# EAGLE design clockport nic (EAGLE 7.6.0)
PROJECT_NAME: Amiga Clockport Network Interface

## Sheet 1 of 2
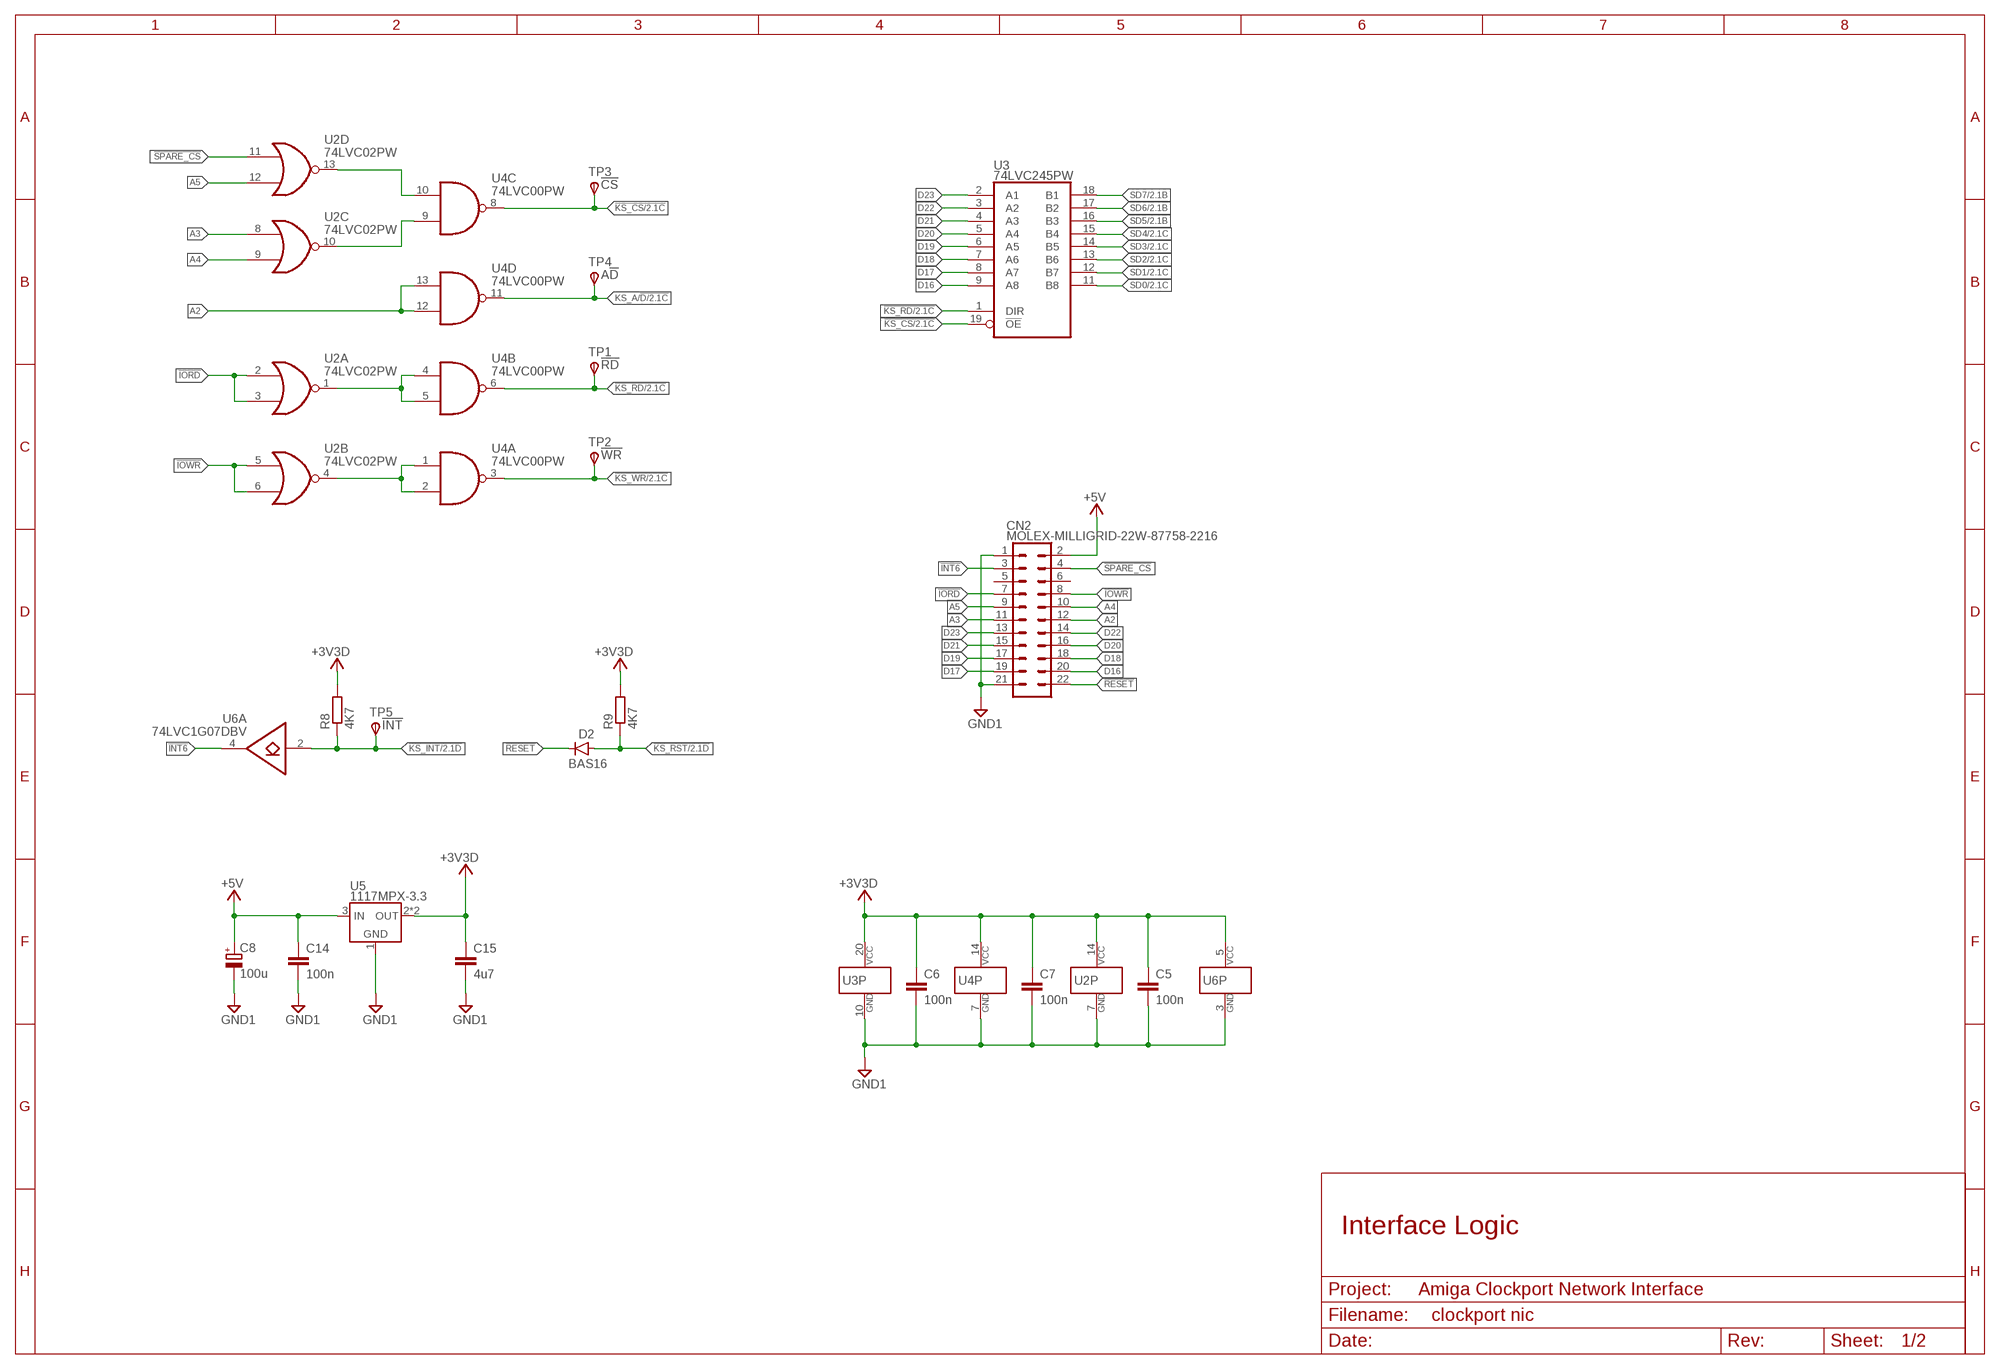
[diagram p0: schematic, sheet 1]

### Parts
C5  100n  C-EUC0603  [C0603]
C6  100n  C-EUC0603  [C0603]
C7  100n  C-EUC0603  [C0603]
C8  100u  CPOL-EUE2.5-6  [E2,5-6]
C14  100n  C-EUC0603  [C0603]
C15  4u7  C-EUC0805  [C0805]
CN2  MOLEX-MILLIGRID-22W-87758-2216  [MOLEX-87758-2216]
D2  BAS16  -DIODE_SOD-323  [SOD323-R]
R8  4K7  R-EU_R0603  [R0603]
R9  4K7  R-EU_R0603  [R0603]
TP1  TPSB1,27  [B1,27]
TP2  TPSB1,27  [B1,27]
TP3  TPSB1,27  [B1,27]
TP4  TPSB1,27  [B1,27]
TP5  TPSB1,27  [B1,27]
U2  74LVC02PW  [TSSOP14]
U3  74LVC245PW  [TSSOP20]
U4  74LVC00PW  [TSSOP14]
U5  1117MPX-3.3  [SOT223]
U6  74LVC1G07DBV  [SOT23-5]

### Nets
!INT6: CN2.3 U6.4(A:O)
!IORD: CN2.7 U2.2(A:I0) U2.3(A:I1)
!IOWR: CN2.8 U2.5(B:I0) U2.6(B:I1)
!KS_CS: TP3.TP(PP) U3.19(!OE) U4.8(C:O) ; also sheet 2
!KS_INT: R8.1 TP5.TP(PP) U6.2(A:I) ; also sheet 2
!KS_RD: TP1.TP(PP) U3.1(DIR) U4.6(B:O) ; also sheet 2
!KS_RST: D2.A R9.1 ; also sheet 2
!KS_WR: TP2.TP(PP) U4.3(A:O) ; also sheet 2
!RESET: CN2.22 D2.K(C)
!SPARE_CS: CN2.4 U2.11(D:I0)
+3V3D: C5.1 C6.1 C7.1 C15.1 R8.2 R9.2 U2.14(P:VCC) U3.20(VCC) U4.14(P:VCC) U5.2(OUT) U5.4(OUT) U6.5(P:VCC) ; also sheet 2
+5V: C8.+ C14.1 CN2.2 U5.3(IN)
A2: CN2.12 U4.12(D:I1) U4.13(D:I0)
A3: CN2.11 U2.8(C:I0)
A4: CN2.10 U2.9(C:I1)
A5: CN2.9 U2.12(D:I1)
D16: CN2.20 U3.9(A8)
D17: CN2.19 U3.8(A7)
D18: CN2.18 U3.7(A6)
D19: CN2.17 U3.6(A5)
D20: CN2.16 U3.5(A4)
D21: CN2.15 U3.4(A3)
D22: CN2.14 U3.3(A2)
D23: CN2.13 U3.2(A1)
GND1: C5.2 C6.2 C7.2 C8.- C14.2 C15.2 CN2.1 CN2.21 U2.7(P:GND) U3.10(GND) U4.7(P:GND) U5.1(GND) U6.3(P:GND) ; also sheet 2
KS_A/!D: TP4.TP(PP) U4.11(D:O) ; also sheet 2
N$1: U2.4(B:O) U4.1(A:I0) U4.2(A:I1)
N$2: U2.1(A:O) U4.4(B:I0) U4.5(B:I1)
N$13: U2.10(C:O) U4.9(C:I1)
N$14: U2.13(D:O) U4.10(C:I0)
SD0: U3.11(B8) ; also sheet 2
SD1: U3.12(B7) ; also sheet 2
SD2: U3.13(B6) ; also sheet 2
SD3: U3.14(B5) ; also sheet 2
SD4: U3.15(B4) ; also sheet 2
SD5: U3.16(B3) ; also sheet 2
SD6: U3.17(B2) ; also sheet 2
SD7: U3.18(B1) ; also sheet 2
Unconnected: CN2.5 CN2.6

### Notes on the sheet
- Interface Logic

## Sheet 2 of 2
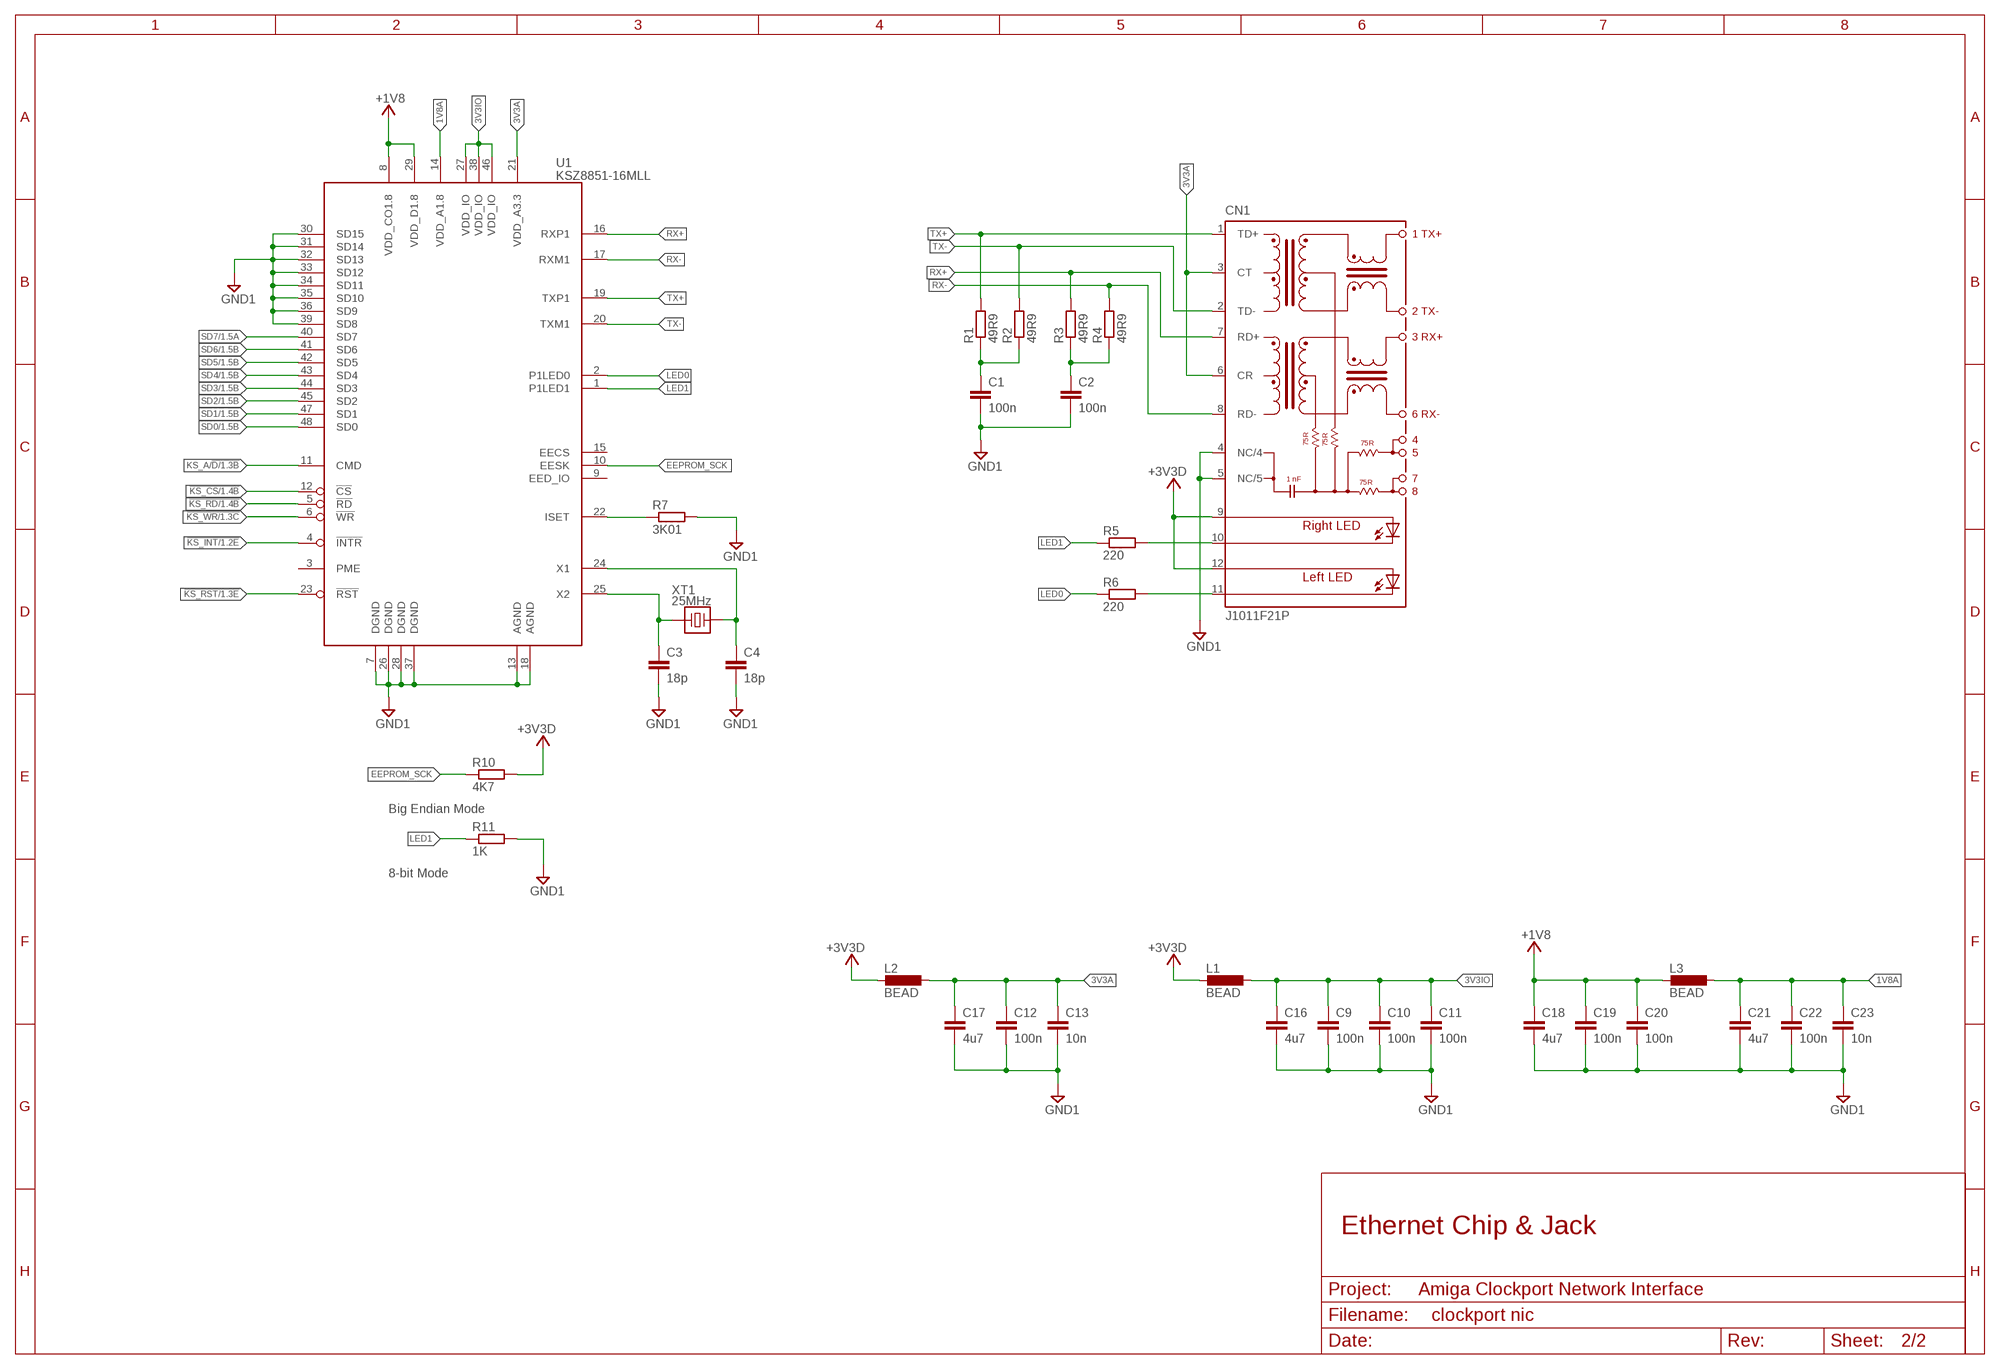
[diagram p1: schematic, sheet 2]

### Parts
C1  100n  C-EUC0603  [C0603]
C2  100n  C-EUC0603  [C0603]
C3  18p  C-EUC0603  [C0603]
C4  18p  C-EUC0603  [C0603]
C9  100n  C-EUC0603  [C0603]
C10  100n  C-EUC0603  [C0603]
C11  100n  C-EUC0603  [C0603]
C12  100n  C-EUC0603  [C0603]
C13  10n  C-EUC0603  [C0603]
C16  4u7  C-EUC0805  [C0805]
C17  4u7  C-EUC0805  [C0805]
C18  4u7  C-EUC0805  [C0805]
C19  100n  C-EUC0603  [C0603]
C20  100n  C-EUC0603  [C0603]
C21  4u7  C-EUC0805  [C0805]
C22  100n  C-EUC0603  [C0603]
C23  10n  C-EUC0603  [C0603]
CN1  J1011F21P  [J1]
L1  BEAD  L-EUL2012C  [L2012C]
L2  BEAD  L-EUL2012C  [L2012C]
L3  BEAD  L-EUL2012C  [L2012C]
R1  49R9  R-EU_R0603  [R0603]
R2  49R9  R-EU_R0603  [R0603]
R3  49R9  R-EU_R0603  [R0603]
R4  49R9  R-EU_R0603  [R0603]
R5  220  R-EU_R0603  [R0603]
R6  220  R-EU_R0603  [R0603]
R7  3K01  R-EU_R0603  [R0603]
R10  4K7  R-EU_R0603  [R0603]
R11  1K  R-EU_R0603  [R0603]
U1  KSZ8851-16MLL  [LQFP48]
XT1  25MHz  XTAL_3225  [3225_4PAD]

### Nets
1V8A: C21.1 C22.1 C23.1 L3.1 U1.14(VDD_A1.8)
3V3A: C12.1 C13.1 C17.1 CN1.3(CT) CN1.6(CR) L2.1 U1.21(VDD_A3.3)
3V3IO: C9.1 C10.1 C11.1 C16.1 L1.1 U1.27(VDD_IO) U1.38(VDD_IO) U1.46(VDD_IO)
!KS_CS: U1.12(!CS) ; also sheet 1
!KS_INT: U1.4(!INTR) ; also sheet 1
!KS_RD: U1.5(!RD) ; also sheet 1
!KS_RST: U1.23(!RST) ; also sheet 1
!KS_WR: U1.6(!WR) ; also sheet 1
+1V8: C18.1 C19.1 C20.1 L3.2 U1.8(VDD_CO1.8) U1.29(VDD_D1.8)
+3V3D: CN1.9(A-R) CN1.12(AL) L1.2 L2.2 R10.2 ; also sheet 1
EEPROM_SCK: R10.1 U1.10(EESK)
GND1: C1.2 C2.2 C3.2 C4.2 C9.2 C10.2 C11.2 C12.2 C13.2 C16.2 C17.2 C18.2 C19.2 C20.2 C21.2 C22.2 C23.2 CN1.4(NC/4) CN1.5(NC/5) R7.2 R11.2 U1.7(DGND) U1.13(AGND) U1.18(AGND) U1.26(DGND) U1.28(DGND) U1.30(SD15) U1.31(SD14) U1.32(SD13) U1.33(SD12) U1.34(SD11) U1.35(SD10) U1.36(SD9) U1.37(DGND) U1.39(SD8) ; also sheet 1
ISET: R7.1 U1.22(ISET)
KS_A/!D: U1.11(CMD) ; also sheet 1
LED0: R6.1 U1.2(P1LED0)
LED1: R5.1 R11.1 U1.1(P1LED1)
N$6: C2.1 R3.1 R4.1
N$7: CN1.11(C-L) R6.2
N$8: CN1.10(C-R) R5.2
N$9: C1.1 R1.1 R2.1
RX+: CN1.7(RD+) R3.2 U1.16(RXP1)
RX-: CN1.8(RD-) R4.2 U1.17(RXM1)
SD0: U1.48(SD0) ; also sheet 1
SD1: U1.47(SD1) ; also sheet 1
SD2: U1.45(SD2) ; also sheet 1
SD3: U1.44(SD3) ; also sheet 1
SD4: U1.43(SD4) ; also sheet 1
SD5: U1.42(SD5) ; also sheet 1
SD6: U1.41(SD6) ; also sheet 1
SD7: U1.40(SD7) ; also sheet 1
TX+: CN1.1(TD+) R1.2 U1.19(TXP1)
TX-: CN1.2(TD-) R2.2 U1.20(TXM1)
XT1: C4.1 U1.24(X1) XT1.3
XT2: C3.1 U1.25(X2) XT1.1
Unconnected: U1.3(PME) U1.9(EED_IO) U1.15(EECS)

### Notes on the sheet
- Big Endian Mode
- 8-bit Mode
- Ethernet Chip & Jack

## Library data of the parts
C1-C7 C9-C23 = rcl:C-EU: CAPACITOR, European symbol
C8 = rcl:CPOL-EU: POLARIZED CAPACITOR, European symbol
CN1 = con-pulse:J1011F: PULSEJACK (TM) 1x1 Tab-UP RJ45 10/100 Base-TX RJ45 1x1 Tab-UP with LEDs 8-pin (J1 series) and 6-pin (JP series) integrated magnetics connector, designed to support applications, such as ADSL modems, LAN-on-Motherboard, and Hub and Switches. Source: www.pulseeng.com .. PulseJack-J402.pdf; OC_FARNELL: unknown; OC_NEWARK: unknown
CN2 = jc-connectors:MOLEX-MILLIGRID-22W-?
D2 = jc-discretesemi:*-DIODE_?
L1-L3 = rcl:L-EU: INDUCTOR, European symbol
R1-R11 = rcl:R-EU_: RESISTOR, European symbol
TP1 = testpad:TPS: TEST PIN; TP_SIGNAL_NAME: !RD
TP2 = testpad:TPS: TEST PIN; TP_SIGNAL_NAME: !WR
TP3 = testpad:TPS: TEST PIN; TP_SIGNAL_NAME: !CS
TP4 = testpad:TPS: TEST PIN; TP_SIGNAL_NAME: A!D
TP5 = testpad:TPS: TEST PIN; TP_SIGNAL_NAME: !INT
U1 = jc-ic:KSZ8851-16MLL
U2 = jc-logic:74*02: Quad 2-input NOR
U3 = jc-logic:74*245
U4 = jc-logic:74*00: Quad 2-input NAND
U5 = jc-vreg:1117?-
U6 = jc-logic:74LVC1G07
XT1 = jc-oscillators:XTAL_*

## Board
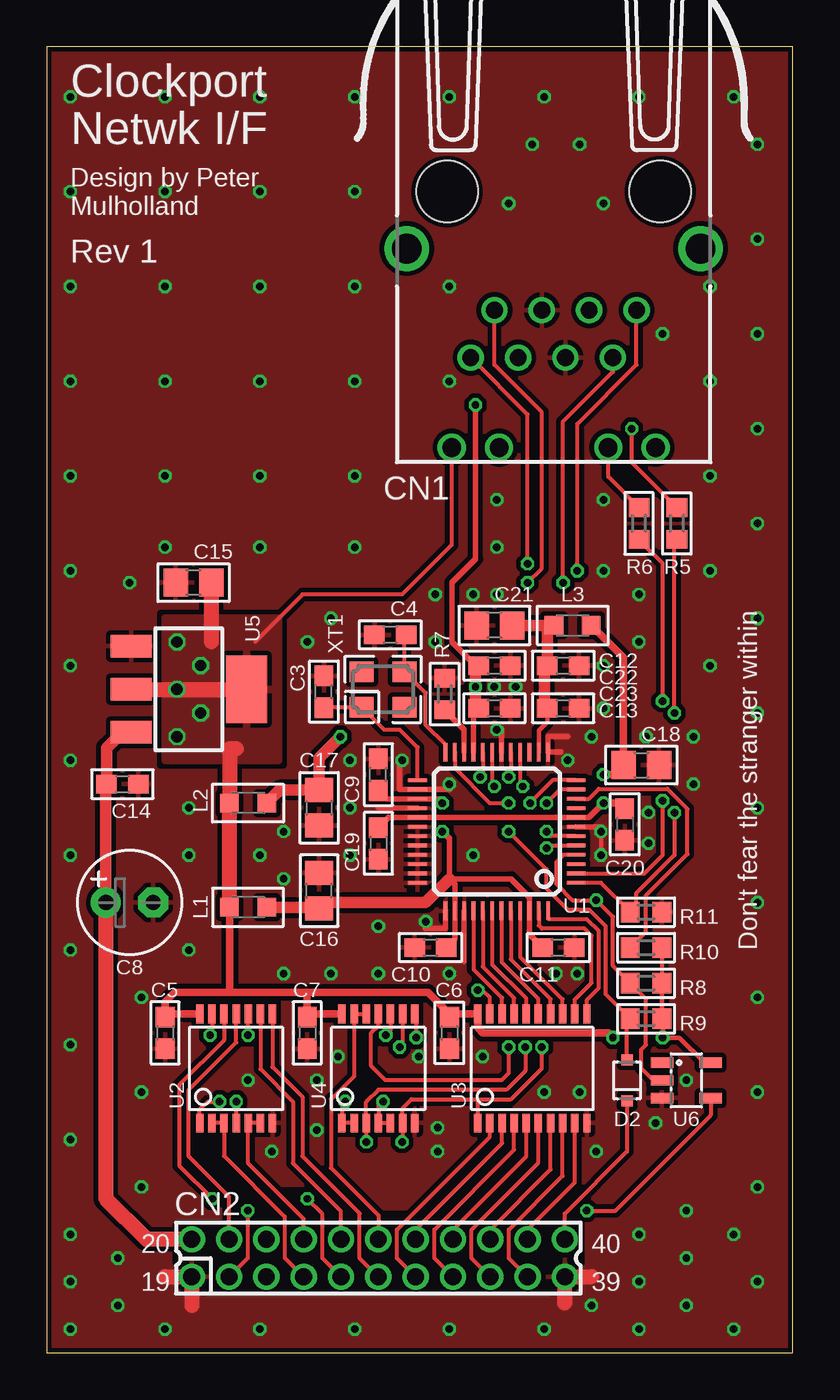
[diagram p2: board, top side]
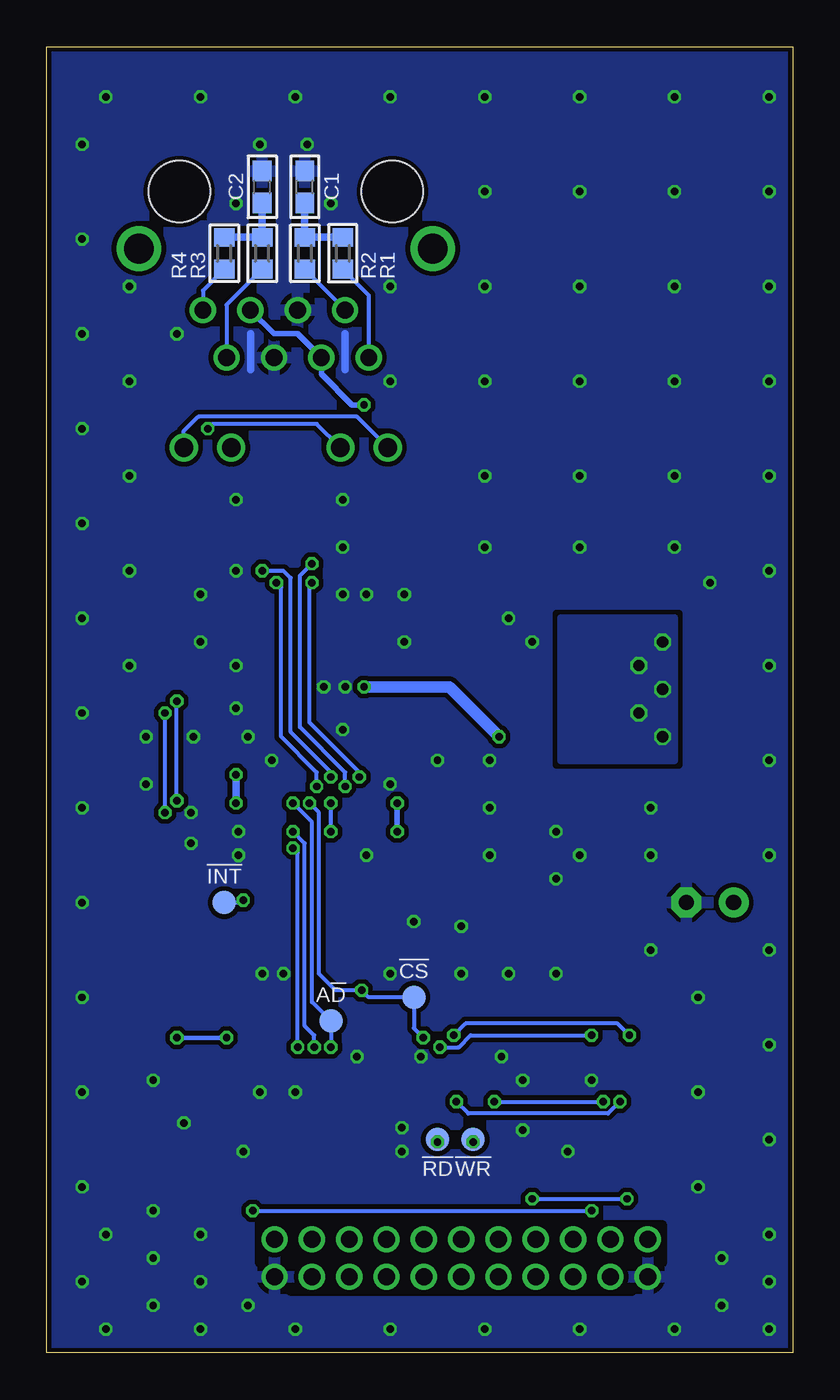
[diagram p3: board, bottom side, seen from below]

Size 40 x 70 mm. Coordinates in mm from the lower left corner, seen from the top.
Outline: 0,0 40,0 40,70 0,70 0,0
Copper layers (1*16): Top 0.035mm / dielectric 1.5mm / Bottom 0.035mm
Design rules "seeed-studio-2-layer": minimum track width 6mil, minimum drill 12mil, track to track 6mil, track to pad 6mil, pad to pad 6mil, via to via 6mil, smd to smd 0mil, copper to edge 10mil, drill to drill 10mil, minimum pad ring 10mil, minimum via ring 6mil, stop-mask expansion 2mil, vias tented up to drill 100mil, thermal gap 10mil
tRestrict: 7 lines
bRestrict: 4 lines

### Footprints (pad centres in the part's own frame; a part is rotated, then mirrored left to right if it is on the bottom)
C0603 = smd 1.1 x 1: 1 -0.85,0; 2 0.85,0
E2,5-6 = drill 0.813 pad 1.6: + -1.27,0 | drill 0.813 pad 1.6 octagon: - 1.27,0
C0805 = smd 1.3 x 1.5: 1 -0.95,0; 2 0.95,0
J1 = drill 0.9 pad 1.3: 1 4.445,2.54; 2 3.175,0; 3 1.905,2.54; 4 0.635,0; 5 -0.635,2.54; 6 -1.905,0; 7 -3.175,2.54; 8 -4.445,0 | drill 1 pad 1.422: 9 5.465,7.37; 10 2.925,7.37; 11 -2.925,7.37; 12 -5.465,7.37 | drill 1.6 pad 2.184: M1 -7.875,-3.3; M2 7.875,-3.3 | hole 3.3: 5.715,-6.35; -5.715,-6.35
MOLEX-87758-2216 = drill 0.9 pad 1.27: 1 -10,-1; 2 -10,1; 3 -8,-1; 4 -8,1; 5 -6,-1; 6 -6,1; 7 -4,-1; 8 -4,1; 9 -2,-1; 10 -2,1; 11 0,-1; 12 0,1; 13 2,-1; 14 2,1; 15 4,-1; 16 4,1; 17 6,-1; 18 6,1; 19 8,-1; 20 8,1; 21 10,-1; 22 10,1
SOD323-R = smd 0.6 x 0.6: A 1.1,0; K -1.1,0
L2012C = smd 1 x 1: 1 -1,0; 2 1,0
R0603 = smd 1 x 1.1: 1 -0.85,0; 2 0.85,0
B1,27 = smd 1.27 x 1.27: TP 0,0
LQFP48 = smd 0.2 x 1: 1 -2.75,-4.25; 2 -2.25,-4.25; 3 -1.75,-4.25; 4 -1.25,-4.25; 5 -0.75,-4.25; 6 -0.25,-4.25; 7 0.25,-4.25; 8 0.75,-4.25; 9 1.25,-4.25; 10 1.75,-4.25; 11 2.25,-4.25; 12 2.75,-4.25; 25 2.75,4.25; 26 2.25,4.25; 27 1.75,4.25; 28 1.25,4.25; 29 0.75,4.25; 30 0.25,4.25; 31 -0.25,4.25; 32 -0.75,4.25; 33 -1.25,4.25; 34 -1.75,4.25; 35 -2.25,4.25; 36 -2.75,4.25 | smd 1 x 0.2: 13 4.25,-2.75; 14 4.25,-2.25; 15 4.25,-1.75; 16 4.25,-1.25; 17 4.25,-0.75; 18 4.25,-0.25; 19 4.25,0.25; 20 4.25,0.75; 21 4.25,1.25; 22 4.25,1.75; 23 4.25,2.25; 24 4.25,2.75; 37 -4.25,2.75; 38 -4.25,2.25; 39 -4.25,1.75; 40 -4.25,1.25; 41 -4.25,0.75; 42 -4.25,0.25; 43 -4.25,-0.25; 44 -4.25,-0.75; 45 -4.25,-1.25; 46 -4.25,-1.75; 47 -4.25,-2.25; 48 -4.25,-2.75
TSSOP14 = smd 0.4 x 1: 1 -1.95,-2.925; 2 -1.3,-2.925; 3 -0.65,-2.925; 4 0,-2.925; 5 0.65,-2.925; 6 1.3,-2.925; 7 1.95,-2.925; 8 1.95,2.925; 9 1.3,2.925; 10 0.65,2.925; 11 0,2.925; 12 -0.65,2.925; 13 -1.3,2.925; 14 -1.95,2.925
TSSOP20 = smd 0.4 x 1: 1 -2.925,-2.925; 2 -2.275,-2.925; 3 -1.625,-2.925; 4 -0.975,-2.925; 5 -0.325,-2.925; 6 0.325,-2.925; 7 0.975,-2.925; 8 1.625,-2.925; 9 2.275,-2.925; 10 2.925,-2.925; 11 2.925,2.925; 12 2.275,2.925; 13 1.625,2.925; 14 0.975,2.925; 15 0.325,2.925; 16 -0.325,2.925; 17 -0.975,2.925; 18 -1.625,2.925; 19 -2.275,2.925; 20 -2.925,2.925
SOT223 = smd 1.2 x 2.2: 1 -2.311,-3.099; 2 0,-3.099; 3 2.311,-3.099 | smd 3.6 x 2.2: 4 0,3.099
SOT23-5 = smd 0.55 x 1.2: 1 -0.95,-1.3; 2 0,-1.3; 3 0.95,-1.3; 4 0.95,1.3; 5 -0.95,1.3
3225_4PAD = smd 1.3 x 1.1: 1 -1.15,-0.95; 2 1.15,-0.95; 3 1.15,0.95; 4 -1.15,0.95

### Placement (x,y rotation side)
C1  26.16,62.48 90 bottom
C2  28.45,62.48 90 bottom
C3  14.86,35.43 90 top
C4  18.41,38.48 180 top
C5  6.35,17.14 270 top
C6  21.59,17.14 270 top
C7  13.97,17.14 270 top
C8  4.45,24.13 0 top
C9  17.78,30.99 90 top
C10  20.57,21.72 180 top
C11  27.43,21.72 0 top
C12  24,36.83 0 top
C13  24,34.54 0 top
C14  4.06,30.48 0 top
C15  7.87,41.27 180 top
C16  14.61,24.77 90 top
C17  14.61,29.21 270 top
C18  31.88,31.5 0 top
C19  17.78,27.3 270 top
C20  30.99,28.32 270 top
C21  24,38.99 180 top
C22  27.69,36.83 0 top
C23  27.69,34.54 0 top
CN1  27.18,55.88 180 top
CN2  17.78,5.08 0 top
D2  31.11,14.61 90 top
L1  10.79,23.88 180 top
L2  10.79,29.46 180 top
L3  28.19,38.99 0 top
R1  24.13,58.93 270 bottom
R2  26.16,58.93 270 bottom
R3  28.45,58.93 270 bottom
R4  30.48,58.93 270 bottom
R5  33.78,44.45 90 top
R6  31.75,44.45 90 top
R7  21.34,35.31 90 top
R8  32.13,19.81 0 top
R9  32.13,17.91 0 top
R10  32.13,21.72 0 top
R11  32.13,23.62 0 top
TP1  19.05,11.43 0 bottom
TP2  17.14,11.43 0 bottom
TP3  20.32,19.05 0 bottom
TP4  24.77,17.78 0 bottom
TP5  30.48,24.13 0 bottom
U1  24.13,27.94 90 top
U2  10.16,15.24 0 top
U3  26.04,15.24 0 top
U4  17.78,15.24 0 top
U5  7.62,35.56 270 top
U6  34.29,14.61 270 top
XT1  18.03,35.56 0 top

### Tracks (layer width: path | path; a pad name or v marks a point on that pad's centre or on a via)
1V8A
  Top 0.254: U1.14 26.38,33.37 26.84,33.82 C23.1
  Top 0.61: C23.1 26.67,34.54 26.67,36.83 C22.1 26.84,38.99 | 26.84,38.99 L3.1 | 26.84,38.99 C21.1
3V3A  (via drill 0.4)
  Top 0.305: v22.99,50.8 22.99,42.55 21.72,41.27 21.72,38.1 22.99,36.83 | U1.21 22.88,34.54 22.99,34.54
  Top 0.61: C13.1 22.99,34.54 v22.99,35.69 22.99,36.83 C12.1 | v15.75,33.02 14.61,31.88 C17.1 12.49,30.16 L2.1
  Bottom 0.305: CN1.6 27.81,54.61 26.54,54.61 CN1.3 25.27,52.45 23.62,50.8 v22.99,50.8
  Bottom 0.61: v15.75,33.02 18.41,35.69 v22.99,35.69
3V3IO  (via drill 0.4)
  Top 0.305: 21.59,25.4 24.89,25.4 25.88,24.41 U1.46 25.88,22.42 C11.1 | v21.21,29.46 20.98,29.69 U1.27 18.23,29.69 C9.1 | 21.59,25.4 21.59,27.56 v21.21,27.94 | C10.1 21.88,22.17 U1.38 21.88,25.11 21.59,25.4
  Top 0.61: 21.59,25.4 20.32,24.13 14.61,24.13 14.61,23.88 | L1.1 14.61,23.88 | 14.61,23.88 C16.1
  Bottom 0.305: v21.21,27.94 v21.21,29.46
!INT6  (via drill 0.4)
  Top 0.203: v10.78,7.62 10.78,5.08 CN2.3 | U6.4 35.59,12.73 30.48,7.62 v28.96,7.62
  Bottom 0.203: v28.96,7.62 v10.78,7.62
!IORD
  Top 0.203: U2.2 U2.3 9.51,10.56 12.76,7.3 12.78,7.3 12.78,5.08 CN2.7
!IOWR
  Top 0.203: U2.6 U2.5 10.81,10.14 13.78,7.17 CN2.8
!KS_CS  (via drill 0.4)
  Top 0.203: v23.11,19.43 23.37,19.43 23.76,19.04 U3.19 | v25.91,29.46 27.13,30.69 U1.12 | U4.8 19.81,18.16 v19.81,16.89
  Bottom 0.203: v25.91,29.46 25.4,28.96 25.4,20.32 24.51,19.43 v23.11,19.43 22.73,19.05 TP3.TP 20.32,17.4 v19.81,16.89
!KS_INT  (via drill 0.4)
  Top 0.203: U1.4 27.71,26.69 27.3,26.29 27.3,25.15 28.19,24.26 v29.46,24.26 30.35,23.37 30.35,20.74 R8.1 32.13,18.96 32.13,16.51 31.88,16.26 31.88,15.24 32.51,14.61 U6.2
  Bottom 0.203: TP5.TP 29.59,24.13 v29.46,24.26
!KS_RD  (via drill 0.4)
  Top 0.203: v26.54,16.38 26.54,15.24 24.89,13.59 23.11,13.59 | 23.11,11.93 U3.1 23.11,13.59 | 23.11,13.59 19.56,13.59 19.08,13.11 U4.6 19.08,11.3 v19.05,11.3 | v26.8,27.05 26.94,27.19 U1.5
  Bottom 0.203: v26.8,27.05 26.54,26.8 v26.54,16.38 | v19.05,11.3 TP1.TP
!KS_RST  (via drill 0.4)
  Top 0.203: v24.77,27.94 26.8,25.91 26.8,24.89 27.94,23.75 29.08,23.75 29.97,22.86 29.97,19.22 R9.1 31.11,17.91 D2.A | U1.23 21.88,31.33 23.75,29.46 v24.77,29.46
  Bottom 0.203: v24.77,27.94 v24.77,29.46
!KS_WR  (via drill 0.4)
  Top 0.203: v26.8,27.94 27.05,27.69 U1.6 | v25.65,16.38 25.65,15.11 24.64,14.1 17.78,14.1 17.13,13.45 U4.3 v17.13,11.3 v17.14,11.3
  Bottom 0.203: v26.8,27.94 26.16,27.3 26.16,17.53 25.65,17.02 v25.65,16.38 | v17.14,11.3 TP2.TP
!RESET
  Top 0.203: D2.K 31.11,10.79 27.78,7.46 CN2.22
!SPARE_CS
  Top 0.203: CN2.4 9.78,8.37 7.62,10.53 7.62,14.1 10.16,16.64 U2.11
+1V8  (via drill 0.4)
  Top 0.305: C19.1 18.32,28.69 U1.29 U1.8 29.07,28.69 v29.84,29.46
  Top 0.406: v29.84,29.46 30.99,29.46 C20.1 | v29.84,30.99 30.93,30.99 C18.1 30.93,37.26 L3.2
  Bottom 0.406: v29.84,29.46 v29.84,30.99
+3V3D  (via drill 0.4, 0.6)
  Top 0.203: CN1.9 21.71,43.3 19.05,40.64 13.72,40.64 11.18,38.1 | R10.2 R8.2
  Top 0.254: R8.2 R9.2 32.98,17.82 33.02,17.82 v33.02,16.89 33.91,16.89 35.24,15.55 U6.5
  Top 0.406: 13.97,19.3 20.45,19.3 21.59,18.16 | 13.97,19.3 C7.1 13.97,18.16 U4.14 | 13.97,19.3 9.79,19.3 | 9.79,19.3 6.86,19.3 6.35,18.8 6.35,18.16 | C6.1 21.59,18.16 | 21.59,18.16 U3.20 23.11,17.4 23.37,17.14 30.1,17.14 v30.35,16.89 | U2.14 6.35,18.16 | 6.35,18.16 C5.1 | L1.2 9.79,19.3
  Top 0.61: 8.82,38.1 8.89,38.1
  Top 0.813: 4.46,35.63 U5.2 v6.99,35.56 U5.4 | 10.16,32.38 9.79,32.38 L2.2 L1.2 | C15.1 8.82,38.1
  Bottom 0.203: CN1.9 23.37,50.16 31.88,50.16 32.64,49.4 CN1.12
  Bottom 0.254: v30.35,16.89 v33.02,16.89
  other vias: 6.99,38.1 8.26,34.29 6.99,33.02 8.26,36.83
  pour Top (isolate 0.305): 6.35,39.37 12.45,39.37 12.45,31.75 6.35,31.75
  pour Bottom (isolate 0.305): 12.45,39.37 6.35,39.37 6.35,31.75 12.45,31.75
+5V
  Top 0.61: U5.3 4.04,33.25 3.21,32.42 C14.1 3.17,30.48 C8.+
  Top 0.813: CN2.2 5.35,6.08 3.17,8.26 C8.+
A2
  Top 0.203: CN2.12 17.78,7.37 15.24,9.91 15.24,13.59 16.48,14.83 U4.13 U4.12
A3
  Top 0.203: U2.8 12.11,15.32 13.72,13.72 13.72,10.54 16.78,7.48 16.78,5.08 CN2.11
A4
  Top 0.203: U2.9 11.46,15.21 13.21,13.46 13.21,10.16 15.78,7.59 CN2.10
A5  (via drill 0.4)
  Top 0.203: U2.12 9.51,16.75 7.11,14.35 7.11,10.03 v8.89,8.26 | CN2.9 14.78,5.08 14.78,7.45 v13.97,8.26
  Bottom 0.203: v13.97,8.26 v8.89,8.26
D16
  Top 0.203: CN2.20 25.78,6.6 28.31,9.13 U3.9
D17
  Top 0.203: CN2.19 24.78,5.08 24.78,6.6 27.66,9.48 U3.8
D18
  Top 0.203: CN2.18 23.78,6.6 27.01,9.83 U3.7
D19
  Top 0.203: CN2.17 22.78,5.08 22.78,6.6 26.36,10.18 U3.6
D20
  Top 0.203: CN2.16 21.78,6.6 25.71,10.53 U3.5
D21
  Top 0.203: CN2.15 20.78,5.08 20.78,6.6 25.06,10.88 U3.4
D22
  Top 0.203: CN2.14 19.78,6.6 24.41,11.23 U3.3
D23
  Top 0.203: CN2.13 18.78,5.08 18.78,6.6 23.76,11.58 U3.2
EEPROM_SCK
  Top 0.203: U1.10 29.05,29.69 29.59,30.23 33.27,30.23 34.35,29.15 34.35,26.73 32.13,24.51 32.13,22.57 R10.1
GND1  (via drill 0.4)
  Top 0.203: 29.72,28.19 v29.72,26.67
  Top 0.305: U1.7 29.72,28.19 | U1.28 17.78,29.19 | 18.92,31.75 18.92,30.19 U1.26 21.59,30.19 v21.59,30.48 | U1.18 24.38,33.4 v24.13,33.4 | 27.56,32.19 U1.13 26.88,33.02 27.94,33.02 | U1.39 22.38,20.98 | U1.37 21.38,22.73 20.32,22.73
  Top 0.813: 6.35,4.08 CN2.1 7.78,2.54 | 29.21,4.08 CN2.21 27.78,2.67
  Bottom 0.406: 24,52.7 24,54.61 | 29.08,52.7 29.08,54.61
  other vias: 20.32,23.11 20.95,12.06 20.95,10.79 28.45,20.32 25.15,35.69 20.83,40.64 27.94,31.75 28.57,13.97 19.05,31.75 23.37,15.88 1.27,1.27 6.35,1.27 11.43,1.27 16.51,1.27 21.59,1.27 26.67,1.27 31.75,1.27 36.83,1.27 1.27,3.81 1.27,6.35 1.27,16.51 1.27,21.59 1.27,26.67 1.27,31.75 11.43,46.99 1.27,46.99 11.43,52.07 1.27,67.31 6.35,67.31 11.43,67.31 16.51,67.31 21.59,67.31 26.67,67.31 31.75,67.31 36.83,67.31 38.1,64.77 38.1,59.69 38.1,54.61 38.1,49.53 38.1,44.45 38.1,39.37 38.1,34.29 38.1,29.21 34.29,5.08 34.29,2.54 29.46,10.79 3.81,2.54 3.81,5.08 1.27,52.07 1.27,57.15 5.08,13.97 15.24,39.37 16.51,43.18 38.1,24.13 35.56,46.99 35.56,41.91 35.56,36.83 35.56,57.15 33.02,54.61 21.59,52.07 21.59,57.15 1.27,62.23 6.35,62.23 11.43,62.23 16.51,62.23 24.77,61.59 29.84,34.54 31.75,38.1 29.84,36.83 6.35,46.99 6.35,57.15 6.35,52.07 11.43,57.15 35.56,52.07 31.75,40.64 21.59,20.32 29.84,61.59 22.86,40.64 24.13,45.72 29.84,45.72 29.84,41.91 20.83,38.1 29.72,27.94 28.57,64.77 26.04,64.77 12.06,10.79 14.48,14.61 14.48,11.94 19.94,15.88 10.79,14.61 15.62,15.88 38.1,19.05 38.1,13.97 38.1,8.89 34.29,14.61 38.1,3.81 31.75,6.35 29.21,2.54 34.29,7.62 13.97,38.1 17.78,20.32 15.24,20.32 7.62,21.59 1.27,36.83 1.27,41.91 1.27,11.43 5.08,8.89 12.7,20.32 7.62,26.67 7.62,29.21 16.51,57.15 16.51,52.07 16.51,46.99 6.35,43.18 11.43,43.18 5.08,19.05 31.75,3.81 36.83,6.35 26.67,13.97 4.45,41.27 32.64,12.32 32.26,28.96 32.26,27.3 24,35.69 17.78,22.86 16.26,31.75 16.26,29.21 16.26,26.67 12.7,27.94 12.7,25.4 29.21,33.02 32.13,33.02 24.13,40.64 24.13,43.18 34.67,33.02 34.67,30.48 27.3,20.32 22.86,26.67 11.43,26.67
  pour Bottom (isolate 0.254, rank 6): 0,69.85 40.64,69.85 40.64,0 0,0
  pour Top (isolate 0.254, rank 6): 0,0 40.64,0 40.64,69.85 0,69.85
ISET
  Top 0.305: R7.1 22.38,33.41 U1.22
KS_A/!D  (via drill 0.4)
  Top 0.203: v26.8,29.46 27.52,30.19 U1.11 | v24.77,16.38 24.77,14.99 24.38,14.61 18.16,14.61 17.4,15.37 17.4,17.14 17.78,17.53 U4.11
  Bottom 0.203: v26.8,29.46 25.78,28.45 25.78,18.8 TP4.TP v24.77,16.38
LED0  (via drill 0.4)
  Top 0.203: v33.02,29.59 33.02,26.67 32.04,25.69 U1.2 | v33.02,34.92 33.02,42.29 31.75,43.56 R6.1
  Bottom 0.203: v33.02,29.59 v33.02,34.92
LED1  (via drill 0.4)
  Top 0.203: v33.66,34.29 33.66,43.6 R5.1 | v33.66,28.96 33.66,26.67 31.62,24.64 31.62,23.62 R11.1 29.71,25.19 U1.1
  Bottom 0.203: v33.66,28.96 v33.66,34.29
N$1  (via drill 0.4)
  Top 0.203: v10.16,13.46 U2.4 | U4.2 U4.1 15.83,13.29 v16,13.46
  Bottom 0.203: v16,13.46 v10.16,13.46
N$2  (via drill 0.4)
  Top 0.203: U4.5 U4.4 17.78,13.21 v18.03,13.46 | U2.1 8.21,13.04 8.64,13.46 v9.27,13.46
  Bottom 0.203: v9.27,13.46 9.91,12.83 17.4,12.83 v18.03,13.46
N$6
  Bottom 0.406: 28.45,61.59 C2.1 R3.1 R4.1
N$7
  Top 0.203: R6.2 30.1,46.95 CN1.11
N$8  (via drill 0.4)
  Top 0.203: R5.2 31.37,47.71 v31.37,49.53
  Bottom 0.203: CN1.10 25.53,49.78 31.11,49.78 v31.37,49.53
N$9
  Bottom 0.406: 26.16,61.59 C1.1 R2.1 R1.1
N$13  (via drill 0.4)
  Top 0.203: U4.9 19.08,16.54 v18.92,16.38 | v10.79,17.02 10.81,17.03 U2.10
  Bottom 0.203: v18.92,16.38 17.91,16.38 17.27,17.02 v10.79,17.02
N$14  (via drill 0.4)
  Top 0.203: U2.13 8.86,17.11 v8.76,17.02 | U4.10 18.43,17.27 v18.18,17.02
  Bottom 0.203: v8.76,17.02 9.4,17.65 17.54,17.65 v18.18,17.02
RX+  (via drill 0.4)
  Top 0.203: v27.69,41.27 27.69,49.91 30.35,52.58 CN1.7 | U1.16 25.38,30.5 v25.53,30.35
  Bottom 0.203: v25.53,30.35 25.53,31.11 27.43,33.02 27.43,41.02 v27.69,41.27 | R3.2 30.35,56.17 CN1.7
RX-  (via drill 0.4)
  Top 0.203: v28.45,41.91 28.45,49.78 31.62,52.96 CN1.8 | U1.17 24.88,30.98 v24.77,30.86
  Bottom 0.203: v24.77,30.86 24.77,31.11 26.92,33.27 26.92,41.53 27.3,41.91 v28.45,41.91 | R4.2 31.62,56.94 CN1.8
SD0
  Top 0.203: U3.11 28.96,18.93 29.59,19.56 29.59,22.61 28.96,23.24 26.92,23.24 26.88,23.29 U1.48
SD1
  Top 0.203: U3.12 28.31,18.93 29.21,19.83 29.21,22.35 28.83,22.73 26.54,22.73 26.38,22.9 U1.47
SD2
  Top 0.203: U3.13 27.66,18.95 25.38,21.23 U1.45
SD3
  Top 0.203: U3.14 27.01,18.96 24.88,21.09 U1.44
SD4
  Top 0.203: U3.15 26.36,18.98 24.38,20.96 U1.43
SD5
  Top 0.203: U3.16 25.71,18.99 23.88,20.82 U1.42
SD6
  Top 0.203: U3.17 25.06,19.01 23.38,20.69 U1.41
SD7
  Top 0.203: U3.18 24.41,19.02 22.88,20.55 U1.40
TX+  (via drill 0.4)
  Top 0.203: v25.78,42.29 25.78,50.29 CN1.1 | U1.19 23.88,30.48 v24,30.35
  Bottom 0.203: v24,30.35 24,31.11 26.42,33.53 26.42,41.66 v25.78,42.29 | R1.2 22.73,56.68 CN1.1
TX-  (via drill 0.4)
  Top 0.203: v25.78,41.27 26.54,42.04 26.54,50.41 24,52.95 CN1.2 | U1.20 23.38,31 v23.24,30.86
  Bottom 0.203: v25.78,41.27 25.91,41.15 25.91,33.78 23.24,31.11 v23.24,30.86 | R2.2 24,55.92 CN1.2
XT1
  Top 0.203: C4.1 19.18,38.48 XT1.3 20.32,35.37 20.32,33.66 21.38,32.59 U1.24
XT2
  Top 0.203: C3.1 14.86,34.61 XT1.1 18.09,33.4 18.92,33.4 19.88,32.44 U1.25

### Text on the board
tPlace: Clockport | Netwk I/F | Design by Peter / Mulholland | Rev 1 | Don't fear the stranger within | 20 | 40 | 19 | 39